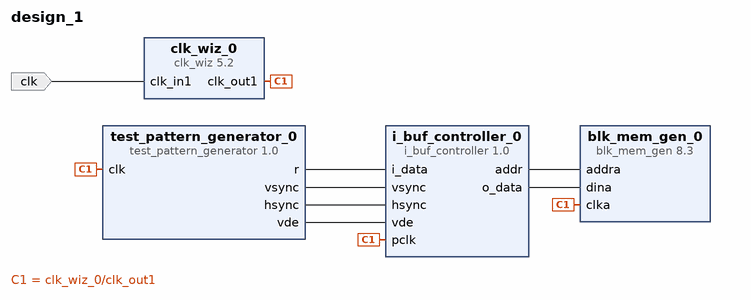
[diagram p0: block diagram of the top level]
# Vivado block design design_1, Vivado 2015.4
create_bd_design design_1

create_bd_port -dir I -type clk clk
set_property -dict {CONFIG.FREQ_HZ 125000000} [get_bd_ports clk]

create_bd_cell -type ip -vlnv xilinx.com:ip:blk_mem_gen:8.3 blk_mem_gen_0
set_property -dict [list \
  CONFIG.Memory_Type True_Dual_Port_RAM \
  CONFIG.Enable_32bit_Address true \
  CONFIG.Assume_Synchronous_Clk false \
  CONFIG.Write_Width_A 32 \
  CONFIG.Write_Depth_A 8192 \
  CONFIG.Read_Width_A 32 \
  CONFIG.Write_Width_B 32 \
  CONFIG.Read_Width_B 32 \
  CONFIG.Enable_B Use_ENB_Pin \
  CONFIG.Register_PortA_Output_of_Memory_Primitives false \
  CONFIG.Register_PortB_Output_of_Memory_Primitives false \
  CONFIG.Use_RSTA_Pin true \
  CONFIG.Use_RSTB_Pin true \
  CONFIG.Port_B_Clock 100 \
  CONFIG.Port_B_Write_Rate 50 \
  CONFIG.Port_B_Enable_Rate 100 \
  CONFIG.use_bram_block BRAM_Controller \
] [get_bd_cells blk_mem_gen_0]
create_bd_cell -type ip -vlnv mikeanthonywild.com:user:i_buf_controller:1.0 i_buf_controller_0
set_property -dict {CONFIG.ADDRESS_WIDTH 31} [get_bd_cells i_buf_controller_0]
create_bd_cell -type ip -vlnv user.org:user:test_pattern_generator:1.0 test_pattern_generator_0
create_bd_cell -type ip -vlnv xilinx.com:ip:clk_wiz:5.2 clk_wiz_0
set_property -dict [list \
  CONFIG.CLKOUT1_REQUESTED_OUT_FREQ 25 \
  CONFIG.MMCM_DIVCLK_DIVIDE 5 \
  CONFIG.MMCM_CLKFBOUT_MULT_F 36.500 \
  CONFIG.MMCM_CLKOUT0_DIVIDE_F 36.500 \
  CONFIG.CLKOUT1_JITTER 312.659 \
  CONFIG.CLKOUT1_PHASE_ERROR 245.713 \
] [get_bd_cells clk_wiz_0]

# ---- connections ----

connect_bd_net [get_bd_pins i_buf_controller_0/addr] [get_bd_pins blk_mem_gen_0/addra]
connect_bd_net [get_bd_pins i_buf_controller_0/o_data] [get_bd_pins blk_mem_gen_0/dina]
connect_bd_net [get_bd_pins test_pattern_generator_0/r] [get_bd_pins i_buf_controller_0/i_data]
connect_bd_net [get_bd_pins test_pattern_generator_0/vsync] [get_bd_pins i_buf_controller_0/vsync]
connect_bd_net [get_bd_pins test_pattern_generator_0/hsync] [get_bd_pins i_buf_controller_0/hsync]
connect_bd_net [get_bd_pins test_pattern_generator_0/vde] [get_bd_pins i_buf_controller_0/vde]
connect_bd_net [get_bd_ports clk] [get_bd_pins clk_wiz_0/clk_in1]
connect_bd_net [get_bd_pins clk_wiz_0/clk_out1] \
  [get_bd_pins test_pattern_generator_0/clk] [get_bd_pins i_buf_controller_0/pclk] [get_bd_pins blk_mem_gen_0/clka]

validate_bd_design
save_bd_design
